# Altium schematic sheet PWR.SchDoc
size A; SheetNumber: 4; SheetTotal: 4
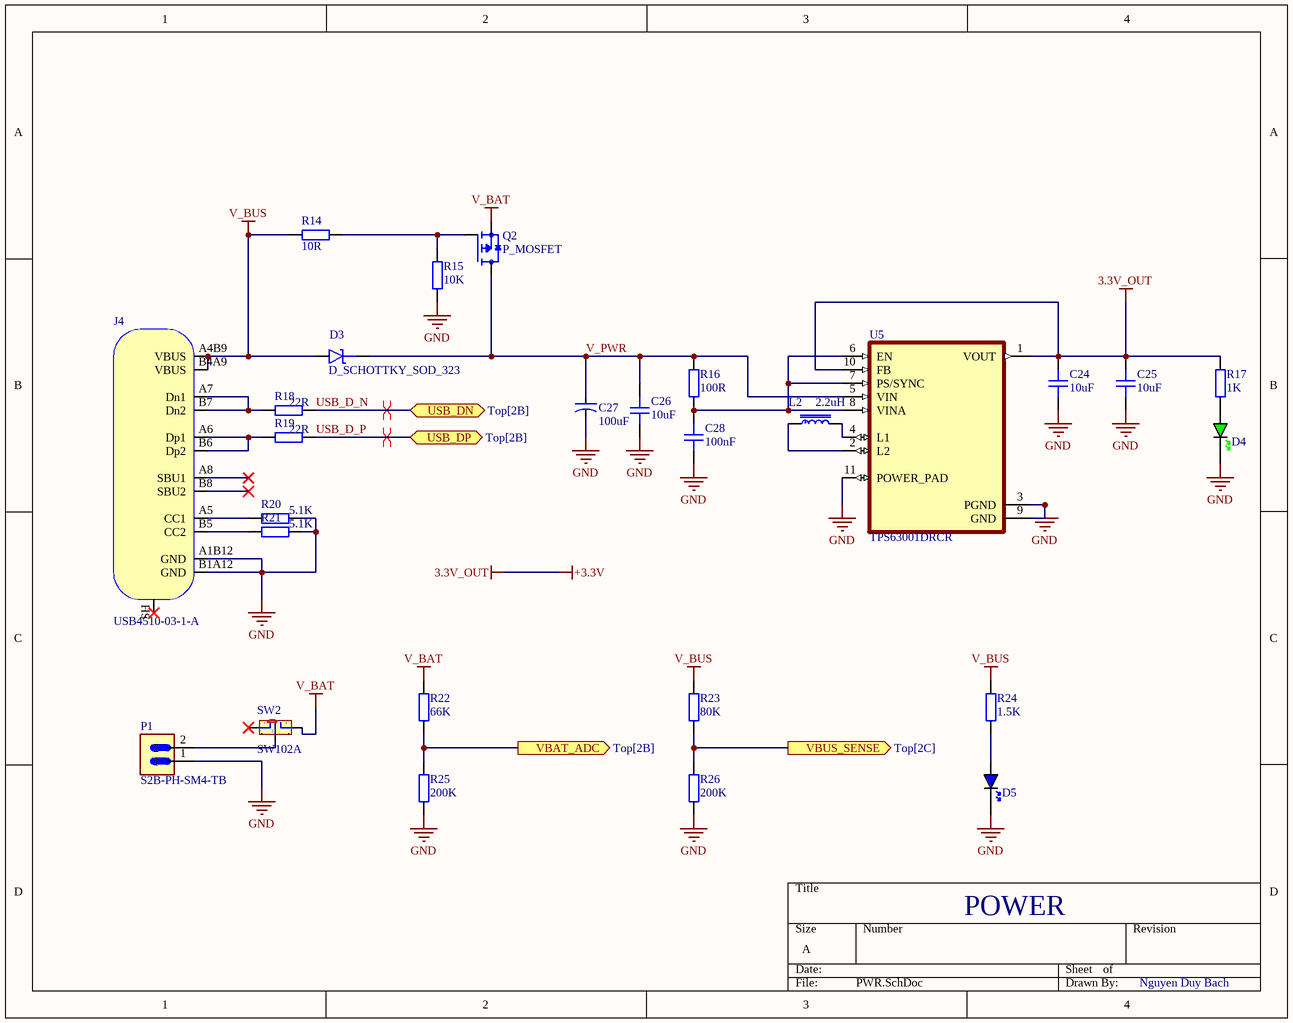
[diagram p0: PWR.SchDoc]

## Parts
C24  10uF  [CAP_1206]
C25  10uF  [CAP_1206]
C26  10uF  [CAP_1206]
C27  100uF  [CAP-ALU-SMD-6.3x7.7x2.2]
C28  100nF  [CAP_0603]
D3  D_SCHOTTKY_SOD_323  [SOD-323]
D4  GREEN  [LED_0805_GREEN]  (value not drawn)
D5  BLUE  [LED_0805_BLUE]  (value not drawn)
J4  USB4510-03-1-A  [USB4510-03-1-A]
L2  2.2uH  [INDC6060X300]
P1  S2B-PH-SM4-TB  [JST_S2B-PH-SM4-TB]
Q2  P_MOSFET  [P_MOSFET_SOT23]
R14  10R  [RES_0603]
R15  10K  [RES_0603]
R16  100R  [RES_1206]
R17  1K  [RES_0805]
R18  22R  [RES_0603]
R19  22R  [RES_0603]
R20  5.1K  [RES_0603]
R21  5.1K  [RES_0603]
R22  66K  [RES_0603]
R23  80K  [RES_0603]
R24  1.5K  [RES_0805]
R25  200K  [RES_0603]
R26  200K  [RES_0603]
SW2  SW102A  [SW102]
U5  TPS63001DRCR  [VREG_V62/16624-01YE]

## Ports
USB_DN (bidir, see Top[2B]), USB_DP (bidir, see Top[2B]), VBAT_ADC (out, see Top[2B]), VBUS_SENSE (out, see Top[2C])

## Nets
+3.3V: C24.2 C25.2 R17.2 U5.1(VOUT) U5.10(FB)  [also labelled 3.3V_OUT]
GND: C24.1 C25.1 C26.1 C27.2 C28.1 D4.K D5.K J4.A1B12(GND) J4.B1A12(GND) P1.1 R15.1 R20.1 R21.1 R25.1 R26.1 U5.3(PGND) U5.9(GND) U5.11(POWER_PAD)
V_BAT: Q2.2(S) R22.2 SW2.3
V_BUS: D3.A J4.A4B9(VBUS) J4.B4A9(VBUS) R14.2 R23.2 R24.2
USB_D_N: R18.1 ; port USB_DN
USB_D_P: R19.1 ; port USB_DP
V_PWR: C26.2 C27.1 D3.K Q2.3(D) R16.2 U5.5(VIN)
VBAT_ADC: R22.1 R25.2 ; port VBAT_ADC
VBUS_SENSE: R23.1 R26.2 ; port VBUS_SENSE
NetC28_2: C28.2 R16.1 U5.6(EN) U5.7(PS/SYNC) U5.8(VINA)
NetD4_A: D4.A R17.1
NetD5_A: D5.A R24.1
NetJ4_A5: J4.A5(CC1) R20.2
NetJ4_A6: J4.A6(Dp1) J4.B6(Dp2) R19.2
NetJ4_A7: J4.A7(Dn1) J4.B7(Dn2) R18.2
NetJ4_B5: J4.B5(CC2) R21.2
NetL2_1: L2.1 U5.2(L2)
NetL2_2: L2.2 U5.4(L1)
NetP1_2: P1.2 SW2.2
NetQ2_1: Q2.1(G) R14.1 R15.2

Not connected (* = marked no-connect by the designer): J4 A8(SBU1)* B8(SBU2)* SH(SHIELD)*; SW2 1* 4 5

## Layout directives
differential pair: USB_D_N, USB_D_P

## Notes on the sheet
- POWER
- Nguyen Duy Bach

## Library data of the parts
C24-C26 = CAP_1206: Capacitor SMD 1206; Manufacturer: *; Manufacturer Part Number: *; Distributor Link: *; LCSC: *; Rating: *; Dielectric: *
C27 = CN-ALU-SMD: Polarized Capacitor (Axial); Published: 8-Jun-2000; LatestRevisionDate: 17-Jul-2002; LatestRevisionNote: Re-released for DXP Platform.; PackageReference: POLAR0.8; Publisher: Altium Limited
C28 = CAP_0603: Capacitor SMD 0603; Manufacturer: *; Manufacturer Part Number: *; Distributor Link: *; LCSC: *; Rating: *; Dielectric: *
D3 = D_SCHOTTKY_SOD_323: Diode Schottky SMD SOD-323
D4 = LED_0805_GREEN: LED 0805 GREEN SMD; Manufacturer: *; Manufacturer Part Number: *; Distributor Link: *; LCSC: *
D5 = LED_0805_BLUE: LED 0805 BLUE SMD; Manufacturer: *; Manufacturer Part Number: *; Distributor Link: *; LCSC: *
J4 = USB4510-03-1-A: USB Connector Type C SMT Mid-Mount 16 Pin; Manufacturer: GCT; Manufacturer Part Number: USB4510-03-1-A
L2 = CSAB0630-100M: SMD Inductor 10uH-20%-5A; MF: Codaca; SnapEDA_Link: https://www.snapeda.com/parts/CSAB0630-100M/Codaca/view-part/?ref=snap; Package: None; Value: *; MP: CSAB0630-100M; Check_prices: https://www.snapeda.com/parts/CSAB0630-100M/Codaca/view-part/?ref=eda
P1 = S2B-PH-SM4-TB: Connector Header Surface Mount, Right Angle 2 position 0.079 (2.00mm); MF: JST Sales; SnapEDA_Link: https://www.snapeda.com/parts/S2B-PH-SM4-TB/JST/view-part/?ref=snap; Package: None; Value: *; MP: S2B-PH-SM4-TB; Check_prices: https://www.snapeda.com/parts/S2B-PH-SM4-TB/JST/view-part/?ref=eda
Q2 = P_MOSFET: MOSFET, SOT-23, P, -30V, -4A, 0.065â„¦, 150Â°C; MF: Diotec Semiconductor; MP: MMFTP3401; SnapEDA_Link: https://www.snapeda.com/parts/MMFTP3401/Diotec/view-part/?ref=snap; Package: SOT-23 Diotec; Value: *; Check_prices: https://www.snapeda.com/parts/MMFTP3401/Diotec/view-part/?ref=eda
R14 R15 R18-R23 R25 R26 = RES_0603: Resistor SMD 0603; Manufacturer: *; Manufacturer Part Number: *; Distributor Link: *; LCSC: *
R16 = RES_1206: Resistor SMD 1206; Manufacturer: *; Manufacturer Part Number: *; Distributor Link: *; LCSC: *
R17 R24 = RES_0805: Resistor SMD 0805; Manufacturer: *; Manufacturer Part Number: *; Distributor Link: *; LCSC: *
SW2 = SW102A: Switch 102 on Broad; Value: Switch 102 On Board
U5 = TPS63001DRCR: 96% Buck-Boost Converter with 1.7A Current Switches, 3.3V fixed Output voltage in 3x3 QFN; MF: Texas Instruments; SnapEDA_Link: https://www.snapeda.com/parts/TPS63001DRCR/Texas+Instruments/view-part/?ref=snap; Package: VSON-10 Texas Instruments; Value: *; MP: TPS63001DRCR; Check_prices: https://www.snapeda.com/parts/TPS63001DRCR/Texas+Instruments/view-part/?ref=eda